# EAGLE design ui_board (EAGLE 9.6.1)
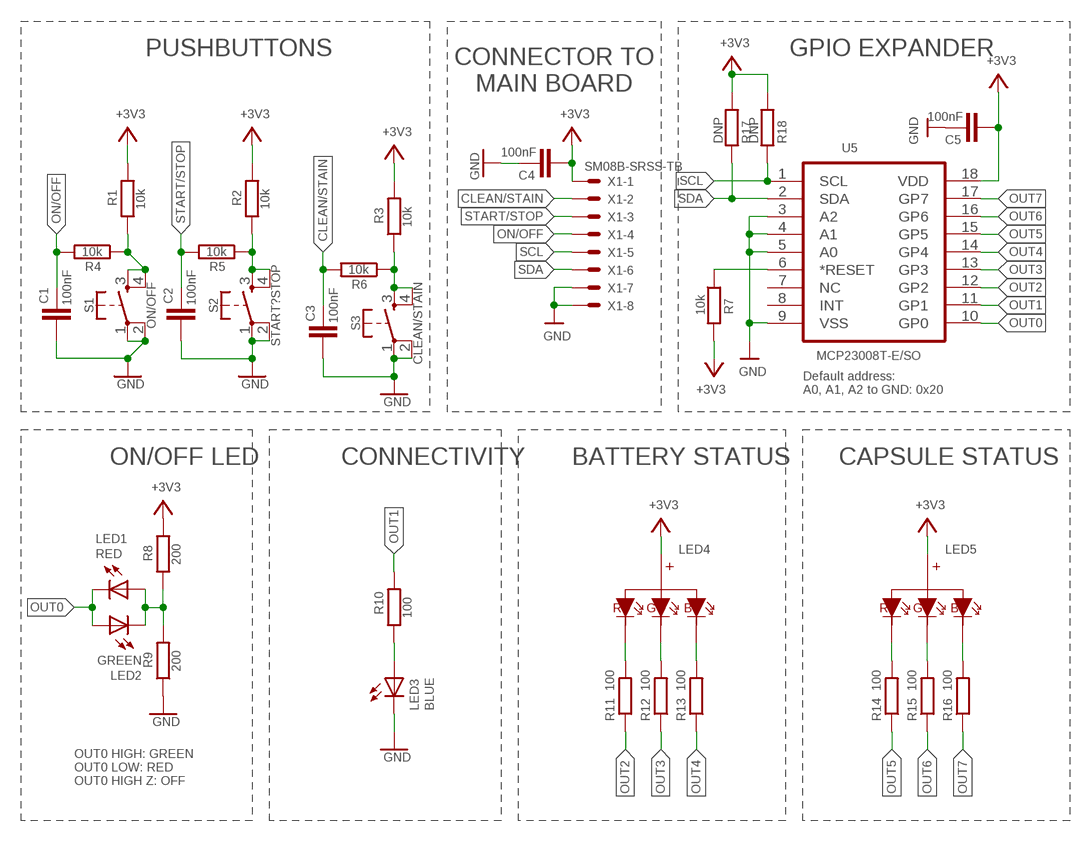
[diagram p0: schematic, sheet 1]

## Parts
C1  100nF  C-EUC0402  [C0402]
C2  100nF  C-EUC0402  [C0402]
C3  100nF  C-EUC0402  [C0402]
C4  100nF  C-EUC0402  [C0402]
C5  100nF  C-EUC0402  [C0402]
LED1  RED  LEDCHIP-LED0603  [CHIP-LED0603]
LED2  GREEN  LEDCHIP-LED0603  [CHIP-LED0603]
LED3  BLUE  LEDCHIP-LED0603  [CHIP-LED0603]
LED4  RGB_CAV1  [19-037A/RSGHBHW]
LED5  RGB_CAV1  [19-037A/RSGHBHW]
R1  10k  R-EU_R0402  [R0402]
R2  10k  R-EU_R0402  [R0402]
R3  10k  R-EU_R0402  [R0402]
R4  10k  R-EU_R0402  [R0402]
R5  10k  R-EU_R0402  [R0402]
R6  10k  R-EU_R0402  [R0402]
R7  10k  R-EU_R0402  [R0402]
R8  200  R-EU_R0402  [R0402]
R9  200  R-EU_R0402  [R0402]
R10  100  R-EU_R0402  [R0402]
R11  100  R-EU_R0402  [R0402]
R12  100  R-EU_R0402  [R0402]
R13  100  R-EU_R0402  [R0402]
R14  100  R-EU_R0402  [R0402]
R15  100  R-EU_R0402  [R0402]
R16  100  R-EU_R0402  [R0402]
R17  DNP  R-EU_R0402  [R0402]
R18  DNP  R-EU_R0402  [R0402]
S1  ON/OFF  MOMENTARY-SWITCH-SPST-2-SMD-5.2MM  [TACTILE_SWITCH_SMD_5.2MM]
S2  START?STOP  MOMENTARY-SWITCH-SPST-2-SMD-5.2MM  [TACTILE_SWITCH_SMD_5.2MM]
S3  CLEAN/STAIN  MOMENTARY-SWITCH-SPST-2-SMD-5.2MM  [TACTILE_SWITCH_SMD_5.2MM]
U5  MCP23008T-E/SO  [SOIC127P1030X265-18N]
X1  SM08B-SRSS-TB  [SM08B-SRSS-TB]

## Nets
+3V3: C4.2 C5.2 LED4.A LED5.A R1.2 R2.2 R3.2 R7.2 R8.2 R17.1 R18.1 U5.18(VDD) X1.1
CLEAN/STAIN: C3.1 R6.2 X1.2
GND: C1.2 C2.2 C3.2 C4.1 C5.1 LED3.C R9.1 S1.1 S1.2 S2.1 S2.2 S3.1 S3.2 U5.3(A2) U5.4(A1) U5.5(A0) U5.9(VSS) X1.7 X1.8
N$1: LED3.A R10.1
N$2: LED4.R R11.2
N$3: R1.1 R4.1 S1.3 S1.4
N$4: R2.1 R5.1 S2.3 S2.4
N$5: R3.1 R6.1 S3.3 S3.4
N$6: LED4.G R12.2
N$7: LED4.B R13.2
N$9: LED5.R R14.2
N$10: LED5.G R15.2
N$11: LED5.B R16.2
N$12: LED1.A LED2.C R8.1 R9.2
N$31: R7.1 U5.6(*RESET)
ON/OFF: C1.1 R4.2 X1.4
OUT0: LED1.C LED2.A U5.10(GP0)
OUT1: R10.2 U5.11(GP1)
OUT2: R11.1 U5.12(GP2)
OUT3: R12.1 U5.13(GP3)
OUT4: R13.1 U5.14(GP4)
OUT5: R14.1 U5.15(GP5)
OUT6: R15.1 U5.16(GP6)
OUT7: R16.1 U5.17(GP7)
SCL: R18.2 U5.1(SCL) X1.5
SDA: R17.2 U5.2(SDA) X1.6
START/STOP: C2.1 R5.2 X1.3
Unconnected: U5.7(NC) U5.8(INT)

## Notes on the sheet
- PUSHBUTTONS | GPIO EXPANDER
- CONNECTOR TO
  MAIN BOARD
- Default address:
  A0, A1, A2 to GND: 0x20
- ON/OFF LED | CONNECTIVITY | BATTERY STATUS | CAPSULE STATUS
- OUT0 HIGH: GREEN
  OUT0 LOW: RED 
  OUT0 HIGH Z: OFF

## Library data of the parts
C1-C5 = rcl:C-EU: CAPACITOR, European symbol; SPICEPREFIX: C
LED1-LED3 = led:LED: LED OSRAM: - CHIPLED LG R971, LG N971, LY N971, LG Q971, LY Q971, LO R971, LY R971 LH N974, LH R974 LS Q976, LO Q976, LY Q976 LO Q996 - Hyper CHIPLED LW Q18S LB Q993, LB Q99A, LB R99A - SideLED LS A670, LO A670, LY A670, LG A670, LP A670 LB A673, LV A673, LT A673, LW A673 LH A674 LY A675 LS A676, LA A676, LO A676, LY A676, LW A676 LS A679, LY A679, LG A679 - Hyper Micro SIDELED® LS Y876, LA Y876, LO Y876, LY Y876 LT Y87S - SmartLED LW L88C, LW L88S LB L89C, LB L89S, LG L890 LS L89K, LO L89K, LY L89K LS L896, LA L896, LO L896, LY L896 - TOPLED LS T670, LO T670, LY T670, LG T670, LP T670 LSG T670, LSP T670, LSY T670, LOP T670, LYG T670 LG T671, LOG T671, LSG T671 LB T673, LV T673, LT T673, LW T673 LH T674 LS T676, LA T676, LO T676, LY T676, LB T676, LH T676, LSB T676, LW T676 LB T67C, LV T67C, LT T67C, LS T67K, LO T67K, LY T67K, LW E67C LS E67B, LA E67B, LO E67B, LY E67B, LB E67C, LV E67C, LT E67C LW T67C LS T679, LY T679, LG T679 LS T770, LO T770, LY T770, LG T770, LP T770 LB T773, LV T773, LT T773, LW T773 LH T774 LS E675, LA E675, LY E675, LS T675 LS T776, LA T776, LO T776, LY T776, LB T776 LHGB T686 LT T68C, LB T68C - Hyper Mini TOPLED® LB M676 - Mini TOPLED Santana® LG M470 LS M47K, LO M47K, LY M47K Source: http://www.osram.convergy.de LUXEON: - LUMILED® LXK2-PW12-R00, LXK2-PW12-S00, LXK2-PW14-U00, LXK2-PW14-V00 LXK2-PM12-R00, LXK2-PM12-S00, LXK2-PM14-U00 LXK2-PE12-Q00, LXK2-PE12-R00, LXK2-PE12-S00, LXK2-PE14-T00, LXK2-PE14-U00 LXK2-PB12-K00, LXK2-PB12-L00, LXK2-PB12-M00, LXK2-PB14-N00, LXK2-PB14-P00, LXK2-PB14-Q00 LXK2-PR12-L00, LXK2-PR12-M00, LXK2-PR14-Q00, LXK2-PR14-R00 LXK2-PD12-Q00, LXK2-PD12-R00, LXK2-PD12-S00 LXK2-PH12-R00, LXK2-PH12-S00 LXK2-PL12-P00, LXK2-PL12-Q00, LXK2-PL12-R00 Source: www.luxeon.com KINGBRIGHT: KA-3528ASYC Source: www.kingbright.com
LED4 LED5 = RGB:RGB_CA
R1-R18 = rcl:R-EU_: RESISTOR, European symbol; SPICEPREFIX: R
S1-S3 = SparkFun-Switches:MOMENTARY-SWITCH-SPST-2: Momentary Switch (Pushbutton) - SPST - Two Circuits Normally-open (NO) SPST momentary switches (buttons, pushbuttons). Schematic symbol includes two switch circuits. Variants SMD-4.6MMX2.8MM - 4.60mm x 2.80mm Tactile Momentary Button Switch - Used on SparkFun SAMD21 Mini Breakout <https://www.sparkfun.com/products/13664> SMD-5.2MM - Mini Pushbutton Switch - SMD <https://www.sparkfun.com/products/8720> - Used on Arduino Pro Mini <https://www.sparkfun.com/products/11114>; PROD_ID: SWCH-08247; SF_SKU: COM-08720
U5 = MCP23008T-E_SO:MCP23008T-E/SO: 8BIT EXPANDER, I/O, I2C I/F; AVAILABILITY: Unavailable; DESCRIPTION: I/O Expander 8 I²C 1.7MHz 18-SOIC; MF: Microchip; MP: MCP23008T-E/SO; PACKAGE: SOIC-18 Microchip; PRICE: None
X1 = con-jst2:?M08B-SRSS-TB: Disconnectable Crimp style connector, 1.0mm pitch 8 contacts

## Board
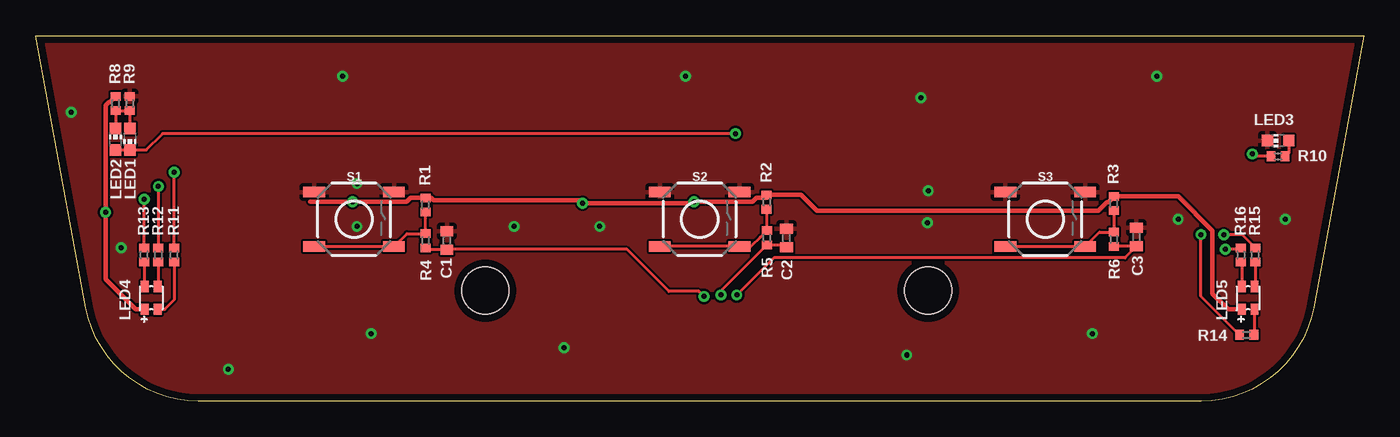
[diagram p1: board, top side]
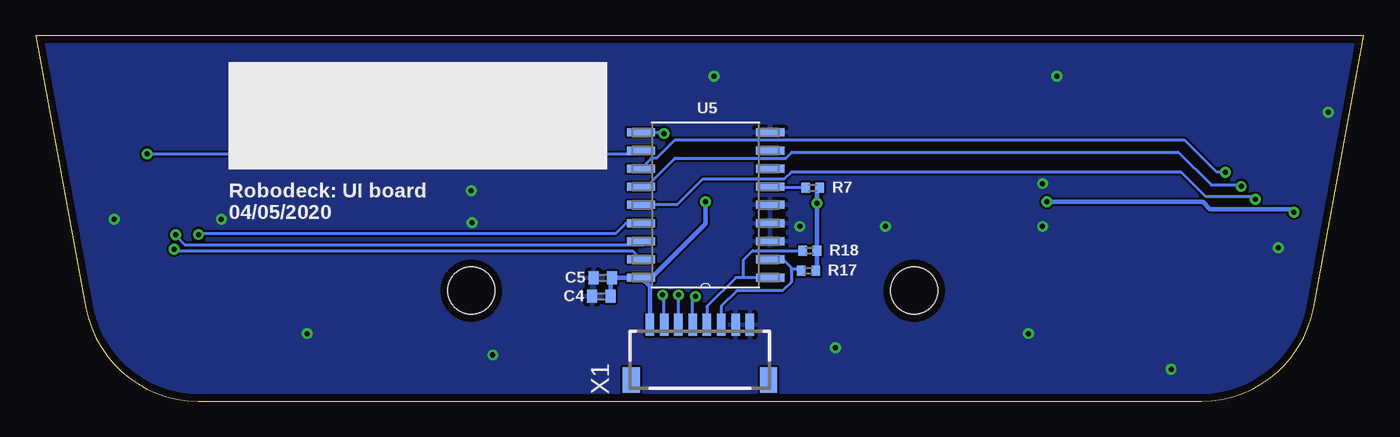
[diagram p2: board, bottom side, seen from below]

Size 92.99 x 25.57 mm. Coordinates in mm from the lower left corner, seen from the top.
Outline: 81.61,0 11.38,0 arc-80 3.51,6.55 0,25.57 92.99,25.57 89.48,6.55 arc-80 81.61,0
Copper layers (1*16): Top 0.035mm / dielectric 1.5mm / Bottom 0.035mm
Design rules "default": minimum track width 6mil, minimum drill 0.35mm, track to track 6mil, track to pad 6mil, pad to pad 6mil, via to via 6mil, smd to smd 6mil, copper to edge 20mil, drill to drill 6mil, minimum pad ring 10mil, minimum via ring 8mil, stop-mask expansion 4mil, vias tented up to drill 0.4mm, thermal gap 10mil
Holes 3.3 mm at 31.49,7.73 62.49,7.73

### Footprints (pad centres in the part's own frame; a part is rotated, then mirrored left to right if it is on the bottom)
C0402 = smd 0.7 x 0.9: 1 -0.65,0; 2 0.65,0
CHIP-LED0603 = smd 0.8 x 0.8: A 0,-0.75; C 0,0.75
19-037A/RSGHBHW = smd 0.8 x 0.55: A 0.8,-0.45; B -0.8,-0.45; G -0.8,0.45; R 0.8,0.45
R0402 = smd 0.6 x 0.7: 1 -0.5,0; 2 0.5,0
TACTILE_SWITCH_SMD_5.2MM = smd 1.524 x 0.762: 1 -2.794,1.905; 2 2.794,1.905; 3 -2.794,-1.905; 4 2.794,-1.905
SOIC127P1030X265-18N = smd 1.981 x 0.559: 1 -4.521,5.08; 2 -4.521,3.81; 3 -4.521,2.54; 4 -4.521,1.27; 5 -4.521,0; 6 -4.521,-1.27; 7 -4.521,-2.54; 8 -4.521,-3.81; 9 -4.521,-5.08; 10 4.521,-5.08; 11 4.521,-3.81; 12 4.521,-2.54; 13 4.521,-1.27; 14 4.521,0; 15 4.521,1.27; 16 4.521,2.54; 17 4.521,3.81; 18 4.521,5.08
SM08B-SRSS-TB = smd 0.6 x 1.55: 1 -3.5,2.975; 2 -2.5,2.975; 3 -1.5,2.975; 4 -0.5,2.975; 5 0.5,2.975; 6 1.5,2.975; 7 2.5,2.975; 8 3.5,2.975 | smd 1.2 x 1.8: FIT@1 -4.8,-0.9; FIT@2 4.8,-0.9

### Placement (x,y rotation side)
C1  28.79,11.23 90 top
C2  52.56,11.43 90 top
C3  77.06,11.48 90 top
C4  53.39,7.33 0 bottom
C5  53.29,8.63 0 bottom
LED1  6.59,18.33 180 top
LED2  5.59,18.33 0 top
LED3  86.99,18.23 90 top
LED4  8.09,7.23 270 top
LED5  84.89,7.23 270 top
R1  27.29,13.73 90 top
R2  51.18,13.93 90 top
R3  75.48,13.83 90 top
R4  27.3,11.23 270 top
R5  51.19,11.43 270 top
R6  75.49,11.33 270 top
R7  38.59,14.93 0 bottom
R8  5.59,20.83 90 top
R9  6.59,20.83 270 top
R10  86.99,17.13 180 top
R11  9.69,10.23 270 top
R12  8.59,10.23 270 top
R13  7.59,10.23 270 top
R14  84.79,4.63 0 top
R15  85.39,10.23 270 top
R16  84.39,10.23 270 top
R17  38.89,9.13 180 bottom
R18  38.79,10.53 180 bottom
S1  22.29,12.73 0 top
S2  46.49,12.73 0 top
S3  70.69,12.73 0 top
U5  46.09,13.73 180 bottom
X1  46.49,2.38 0 bottom

### Tracks (layer width: path | path; a pad name or v marks a point on that pad's centre or on a via)
+3V3  (via drill 0.35)
  Top 0.305: R2.2 51.39,14.43 | 51.39,14.43 53.59,14.43 54.69,13.33 74.4,13.33 75.01,13.93 75.09,13.93 R3.2 79.99,14.33 82.39,11.93 82.39,7.53 83.49,6.43 LED5.A | 51.39,14.43 51.19,14.23 50.45,14.23 50.17,13.94 v46.09,13.94 45.99,13.84 v38.29,13.84 38.09,14.04 37.69,14.04 27.87,14.04 27.69,14.23 | R1.2 27.69,14.23 | 27.69,14.23 26.25,14.23 25.97,13.94 v22.19,13.94 19.21,13.94 | R8.2 5.2,20.93 5.11,20.93 4.89,20.7 v4.89,13.23 4.89,8.53 6.99,6.43 LED4.A
  Bottom 0.305: X1.1 49.99,8.02 U5.18 | U5.18 52.62,8.65 C5.2 52.74,8.53 C4.2 | v22.19,13.94 11.28,13.94 10.78,13.44 5.1,13.44 v4.89,13.23 | U5.18 49.87,8.65 46.09,12.43 v46.09,13.94 | R7.2 38.29,14.93 38.29,13.43 | 38.29,13.43 R18.1 38.29,9.13 R17.1 | 38.29,13.43 v38.29,13.84
CLEAN/STAIN  (via drill 0.35)
  Top 0.2: v49.09,7.43 51.69,10.03 76.26,10.03 C3.1 R6.2
  Bottom 0.2: X1.2 48.99,7.33 v49.09,7.43
GND  (via drill 0.35)
  other vias: 22.49,15.23 22.49,12.23 23.49,4.73 5.99,10.73 2.49,20.23 21.49,22.73 13.49,2.23 45.49,22.73 36.99,3.73 60.99,3.23 61.99,21.23 62.49,14.73 62.44,12.48 73.99,4.73 79.99,12.73 78.49,22.73 87.49,12.73 33.49,12.23 39.49,12.23
  pour Bottom: -2.31,27.93 96.69,27.93 96.69,-4.37 -2.31,-4.37
  pour Top: -2.31,27.83 96.79,27.83 96.79,-4.37 -2.31,-4.37
N$1
  Top 0.2: LED3.A 87.74,17.38 R10.1
N$2
  Top 0.2: R11.2 9.69,7.08 9.04,6.43 LED4.R
N$3
  Top 0.2: R1.1 R4.1 25.99,11.73 S1.4 S1.3
N$4
  Top 0.2: R2.1 R5.1 50.74,11.48 50.08,10.82 S2.4 S2.3
N$5
  Top 0.2: R3.1 R6.1 74.49,11.83 73.59,10.93 | S3.4 73.59,10.93 | S3.3 S3.4 | S3.4 73.59,10.93
N$6
  Top 0.2: R12.2 8.59,8.03 LED4.G
N$7
  Top 0.2: R13.2 7.59,8.03 LED4.B
N$9
  Top 0.2: LED5.R 85.34,4.68 R14.2
N$10
  Top 0.2: R15.2 85.39,8.08 LED5.G
N$11
  Top 0.2: R16.2 84.44,9.68 LED5.B
N$12
  Top 0.2: LED2.C R8.1 R9.2 LED1.A
N$31
  Bottom 0.2: R7.1 41.5,14.93 U5.6
ON/OFF  (via drill 0.35)
  Top 0.2: R4.2 27.45,10.58 C1.1 28.84,10.63 41.39,10.63 44.33,7.69 46.43,7.69 v46.79,7.33
  Bottom 0.2: X1.4 46.99,7.13 v46.79,7.33
OUT0  (via drill 0.35)
  Top 0.2: v48.99,18.73 8.89,18.73 7.74,17.58 6.49,17.58 | LED2.A 6.49,17.58 | LED1.C 6.49,17.58
  Bottom 0.2: U5.10 49.07,18.81 v48.99,18.73
OUT1  (via drill 0.35)
  Top 0.2: R10.2 85.36,17.13 v85.19,17.29
  Bottom 0.2: v85.19,17.29 50.85,17.29 U5.11
OUT2  (via drill 0.35)
  Top 0.2: R11.1 v9.69,16.03
  Bottom 0.2: v9.69,16.03 10.29,16.03 12.54,18.27 48.25,18.27 49.52,17 49.87,17 U5.12
OUT3  (via drill 0.35)
  Top 0.2: v8.59,15.03 R12.1
  Bottom 0.2: U5.13 50.22,15 48.21,17 40.47,17 40.05,17.43 12.99,17.43 10.69,15.13 8.69,15.13 v8.59,15.03
OUT4  (via drill 0.35)
  Top 0.2: R13.1 v7.59,14.13
  Bottom 0.2: v7.59,14.13 7.79,14.33 11.09,14.33 12.79,16.03 40.09,16.03 40.59,15.53 46.29,15.53 48.09,13.73 U5.14
OUT5  (via drill 0.35)
  Top 0.2: R14.1 81.59,7.33 v81.59,11.66
  Bottom 0.2: U5.15 51.67,12.46 52.37,11.76 81.49,11.76 v81.59,11.66
OUT6  (via drill 0.35)
  Top 0.2: R15.1 84.99,11.12 84.99,11.13 84.49,11.63 v83.19,11.63
  Bottom 0.2: v83.19,11.63 83.19,11.59 82.55,10.95 50.37,10.95 U5.16
OUT7  (via drill 0.35)
  Top 0.2: R16.1 84.29,10.63 v83.29,10.63
  Bottom 0.2: U5.17 51.21,10.52 83.28,10.52 83.29,10.53 v83.29,10.63
SCL
  Bottom 0.2: U5.1 43.29,8.65 43.49,8.65 | 43.49,8.65 43.47,8.67 43.47,9.85 42.79,10.53 R18.2 | 43.49,8.65 43.97,8.65 45.99,6.63 X1.5
SDA
  Bottom 0.2: U5.2 40.68,9.92 40.09,9.33 40.09,9.23 | 40.09,9.23 40.09,8.33 40.69,7.73 43.89,7.73 44.99,6.63 X1.6 | R17.2 39.49,9.23 40.09,9.23
START/STOP  (via drill 0.35)
  Top 0.2: v47.99,7.43 47.99,7.73 R5.2 52.41,10.93 C2.1
  Bottom 0.2: X1.3 v47.99,7.43

### Text on the board
bPlace: Robodeck: UI board / 04/05/2020